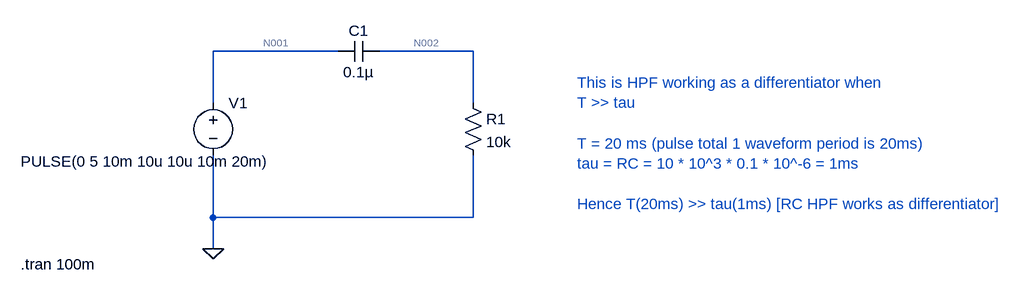
[diagram p0: schematic RC_HPF_as_differentiator.asc]
RC_HPF_as_differentiator.asc, the LTspice schematic file:
Version 4.1
SHEET 1 1092 680
WIRE 0 0 -192 0
WIRE 208 0 64 0
WIRE -192 80 -192 0
WIRE 208 80 208 0
WIRE -192 256 -192 160
WIRE 208 256 208 160
WIRE 208 256 -192 256
WIRE -192 304 -192 256
FLAG -192 304 0
SYMBOL voltage -192 64 R0
WINDOW 3 -296 106 Left 2
WINDOW 123 0 0 Left 0
WINDOW 39 0 0 Left 0
SYMATTR InstName V1
SYMATTR Value PULSE(0 5 10m 10u 10u 10m 20m)
SYMBOL cap 64 -16 R90
WINDOW 0 0 32 VBottom 2
WINDOW 3 32 32 VTop 2
SYMATTR InstName C1
SYMATTR Value 0.1µ
SYMBOL res 192 64 R0
SYMATTR InstName R1
SYMATTR Value 10k
TEXT 368 48 Left 2 ;This is HPF working as a differentiator when\nT >> tau\n \nT = 20 ms (pulse total 1 waveform period is 20ms)\ntau = RC = 10 * 10^3 * 0.1 * 10^-6 = 1ms\n \nHence T(20ms) >> tau(1ms) [RC HPF works as differentiator]
TEXT -488 328 Left 2 !.tran 100m

The netlist it stands for:
* RC_HPF_as_differentiator.asc
V1 N001 0 PULSE(0 5 10m 10u 10u 10m 20m)
C1 N002 N001 0.1µ
R1 N002 0 10k
* This is HPF working as a differentiator when
* T >> tau
* T = 20 ms (pulse total 1 waveform period is 20ms)
* tau = RC = 10 * 10^3 * 0.1 * 10^-6 = 1ms
* Hence T(20ms) >> tau(1ms) [RC HPF works as differentiator]
.tran 100m
.backanno
.end

* Results of the author's LTspice run, read from the files saved beside the schematic
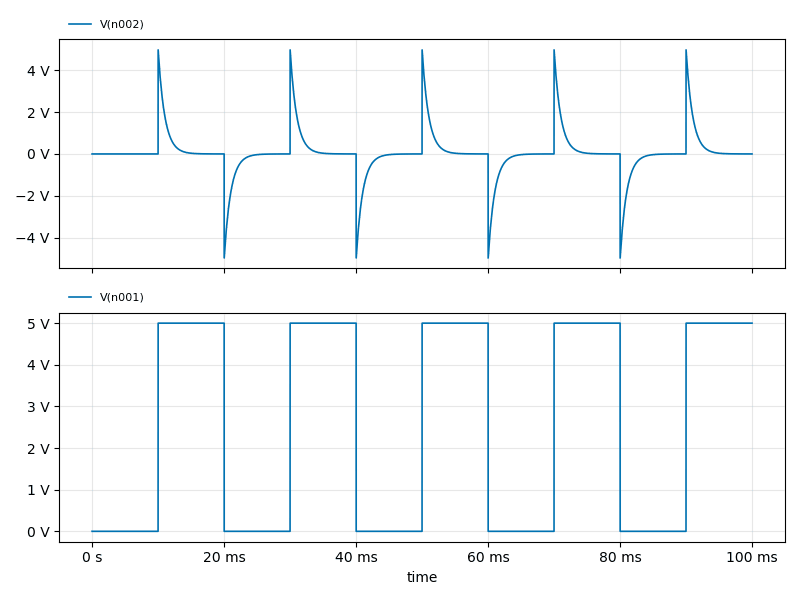
[diagram p1: Transient Analysis of RC_HPF_as_differentiator.asc, plotted from the saved traces]
* Transient Analysis, 1 run:
*   V(n002): min -4.975 V, max 4.975 V, average 49.92 mV, rms 1.07 V, last 226.3 µV
*   V(n001): min 0 V, max 5 V, average 2.502 V, rms 3.536 V, last 5 V